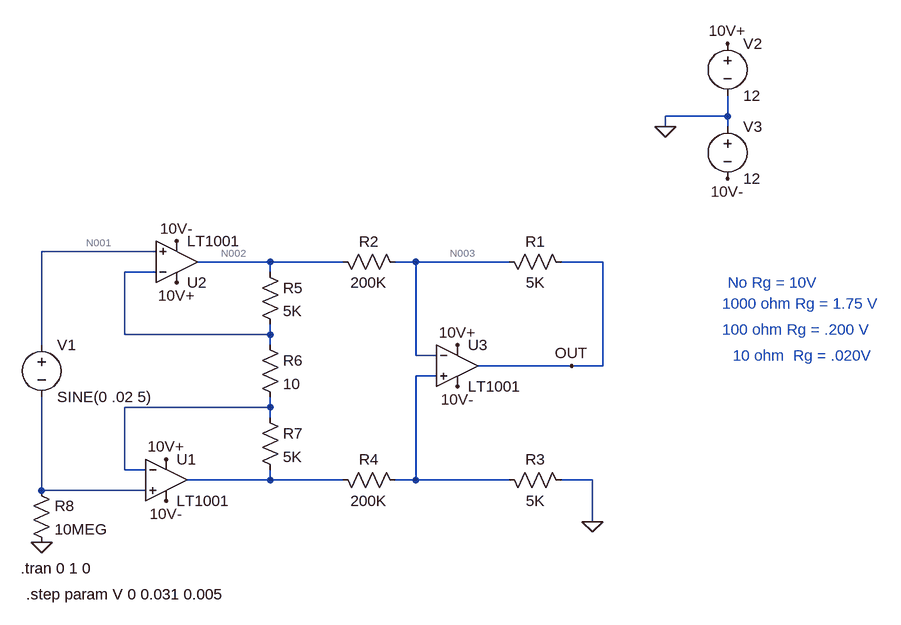
[diagram p0: schematic InAmp.asc]
InAmp.asc, the LTspice schematic file:
Version 4
SHEET 1 1284 680
WIRE 976 -288 976 -320
WIRE 976 -288 880 -288
WIRE 880 -272 880 -288
WIRE 976 -272 976 -288
WIRE 96 -80 -80 -80
WIRE 272 -64 160 -64
WIRE 384 -64 272 -64
WIRE 496 -64 464 -64
WIRE 640 -64 496 -64
WIRE 784 -64 720 -64
WIRE 96 -48 48 -48
WIRE 272 -48 272 -64
WIRE 48 48 48 -48
WIRE 272 48 272 32
WIRE 272 48 48 48
WIRE -80 64 -80 -80
WIRE 272 64 272 48
WIRE 496 80 496 -64
WIRE 528 80 496 80
WIRE 736 96 592 96
WIRE 784 96 784 -64
WIRE 784 96 736 96
WIRE 528 112 496 112
WIRE 272 160 272 144
WIRE 272 160 48 160
WIRE 272 176 272 160
WIRE 48 256 48 160
WIRE 80 256 48 256
WIRE 272 272 272 256
WIRE 272 272 144 272
WIRE 384 272 272 272
WIRE 496 272 496 112
WIRE 496 272 464 272
WIRE 640 272 496 272
WIRE 768 272 720 272
WIRE -80 288 -80 144
WIRE 80 288 -80 288
WIRE 768 336 768 272
FLAG 128 -32 10V+
FLAG 112 240 10V+
FLAG 560 64 10V+
FLAG 128 -96 10V-
FLAG 560 128 10V-
FLAG 112 304 10V-
FLAG 880 -272 0
FLAG 768 336 0
FLAG -80 368 0
FLAG 976 -192 10V-
FLAG 976 -400 10V+
FLAG 736 96 OUT
SYMBOL Opamps\\LT1001 112 208 R0
SYMATTR InstName U1
SYMBOL Opamps\\LT1001 128 0 M180
SYMATTR InstName U2
SYMBOL Opamps\\LT1001 560 32 R0
SYMATTR InstName U3
SYMBOL res 624 -80 M90
WINDOW 0 0 56 VBottom 2
WINDOW 3 32 56 VTop 2
SYMATTR InstName R1
SYMATTR Value 5K
SYMBOL res 368 -80 M90
WINDOW 0 0 56 VBottom 2
WINDOW 3 32 56 VTop 2
SYMATTR InstName R2
SYMATTR Value 200K
SYMBOL res 624 256 M90
WINDOW 0 0 56 VBottom 2
WINDOW 3 32 56 VTop 2
SYMATTR InstName R3
SYMATTR Value 5K
SYMBOL res 368 256 M90
WINDOW 0 0 56 VBottom 2
WINDOW 3 32 56 VTop 2
SYMATTR InstName R4
SYMATTR Value 200K
SYMBOL res 256 -64 R0
SYMATTR InstName R5
SYMATTR Value 5K
SYMBOL res 256 160 R0
SYMATTR InstName R7
SYMATTR Value 5K
SYMBOL voltage -80 48 R0
WINDOW 123 0 0 Left 2
WINDOW 39 0 0 Left 2
SYMATTR InstName V1
SYMATTR Value SINE(0 .02 5)
SYMBOL voltage 976 -416 R0
WINDOW 123 0 0 Left 2
WINDOW 39 0 0 Left 2
SYMATTR InstName V2
SYMATTR Value 12
SYMBOL voltage 976 -288 R0
WINDOW 123 0 0 Left 2
WINDOW 39 0 0 Left 2
SYMATTR InstName V3
SYMATTR Value 12
SYMBOL res -96 272 R0
SYMATTR InstName R8
SYMATTR Value 10MEG
SYMBOL res 256 48 R0
SYMATTR InstName R6
SYMATTR Value 10
TEXT -112 408 Left 2 !.tran 0 1 0
TEXT -104 448 Left 2 !.step param V 0 0.031 0.005
TEXT 968 0 Left 2 ;1000 ohm Rg = 1.75 V
TEXT 968 40 Left 2 ;100 ohm Rg = .200 V
TEXT 984 80 Left 2 ;10 ohm  Rg = .020V
TEXT 976 -32 Left 2 ;No Rg = 10V

The netlist it stands for:
* InAmp.asc
XU1 N008 N006 10V+ 10V- N007 LT1001  ; pins In+ In- V+ V- OUT
XU2 N001 N004 10V+ 10V- N002 LT1001  ; pins In+ In- V+ V- OUT
XU3 N005 N003 10V+ 10V- OUT LT1001  ; pins In+ In- V+ V- OUT
R1 N003 OUT 5K
R2 N002 N003 200K
R3 N005 0 5K
R4 N007 N005 200K
R5 N002 N004 5K
R7 N006 N007 5K
V1 N001 N008 SINE(0 .02 5)
V2 10V+ 0 12
V3 0 10V- 12
R8 N008 0 10MEG
R6 N004 N006 10
.tran 0 1 0
.step param V 0 0.031 0.005
* 1000 ohm Rg = 1.75 V
* 100 ohm Rg = .200 V
* 10 ohm  Rg = .020V
* No Rg = 10V
.lib LTC.lib
.backanno
.end

* Results of the author's LTspice run, read from the files saved beside the schematic
* Operating Point, zero values left out:
*   V(10v+) = 12 V
*   V(10v-) = -12 V
*   I(V3) = -6.75 mA
*   I(V2) = -6.75 mA
*   Ix(u1:3) = 2.25 mA
*   Ix(u1:4) = -2.25 mA
*   Ix(u2:3) = 2.25 mA
*   Ix(u2:4) = -2.25 mA
*   Ix(u3:3) = 2.25 mA
*   Ix(u3:4) = -2.25 mA
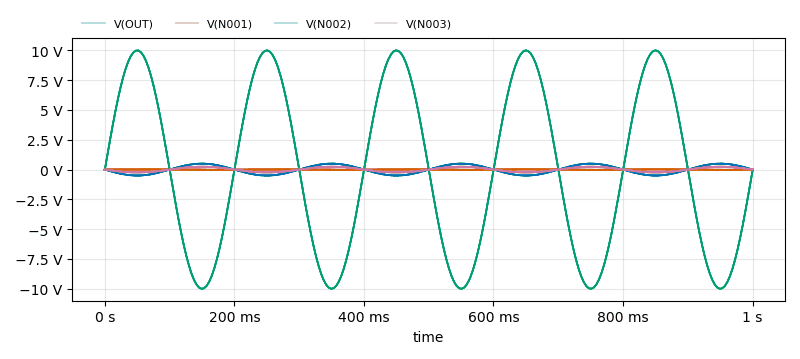
[diagram p1: Transient Analysis of InAmp.asc, plotted from the saved traces]
* Transient Analysis, 11 runs:
*   V(OUT) [run 1]: min -499.6 mV, max 499.6 mV, average -1.112 µV, rms 353.3 mV, last 2.953 mV
*   V(OUT) [run 2]: 0.1257 fV at time=0 s, 0.1257 fV at time=0 s, min 0.1257 fV, max 0.1257 fV
*   V(OUT) [run 3]: min -499.6 mV, max 499.6 mV, average -306.4 nV, rms 353.3 mV, last 2.953 mV
*   V(OUT) [run 4]: 0.1257 fV at time=0 s, 0.1257 fV at time=0 s, min 0.1257 fV, max 0.1257 fV
*   V(OUT) [run 5]: min -499.6 mV, max 499.6 mV, average -306.4 nV, rms 353.3 mV, last 2.953 mV
*   V(OUT) [run 6]: 0.1257 fV at time=0 s, 0.1257 fV at time=0 s, min 0.1257 fV, max 0.1257 fV
*   V(OUT) [run 7]: min -499.6 mV, max 499.6 mV, average -306.4 nV, rms 353.3 mV, last 2.953 mV
*   V(OUT) [run 8]: 0.1257 fV at time=0 s, 0.1257 fV at time=0 s, min 0.1257 fV, max 0.1257 fV
*   V(N001) [run 1]: min -19.99 mV, max 19.99 mV, average 15.91 nV, rms 14.14 mV, last -6.299 µV
*   V(N001) [run 2]: -0.0004993 fV at time=0 s, -0.0004993 fV at time=0 s, min -0.0004993 fV, max -0.0004993 fV
*   V(N001) [run 3]: min -19.99 mV, max 19.99 mV, average -17 nV, rms 14.14 mV, last -6.299 µV
*   V(N001) [run 4]: -0.0004993 fV at time=0 s, -0.0004993 fV at time=0 s, min -0.0004993 fV, max -0.0004993 fV
*   V(N001) [run 5]: min -19.99 mV, max 19.99 mV, average -17 nV, rms 14.14 mV, last -6.299 µV
*   V(N001) [run 6]: -0.0004993 fV at time=0 s, -0.0004993 fV at time=0 s, min -0.0004993 fV, max -0.0004993 fV
*   V(N001) [run 7]: min -19.99 mV, max 19.99 mV, average -17 nV, rms 14.14 mV, last -6.299 µV
*   V(N001) [run 8]: -0.0004993 fV at time=0 s, -0.0004993 fV at time=0 s, min -0.0004993 fV, max -0.0004993 fV
*   V(N002) [run 1]: min -10 V, max 10 V, average 22.24 µV, rms 7.074 V, last -59 mV
*   V(N002) [run 2]: -2.517 fV at time=0 s, -2.517 fV at time=0 s, min -2.517 fV, max -2.517 fV
*   V(N002) [run 3]: min -10 V, max 10 V, average 6.112 µV, rms 7.074 V, last -59 mV
*   V(N002) [run 4]: -2.517 fV at time=0 s, -2.517 fV at time=0 s, min -2.517 fV, max -2.517 fV
*   V(N002) [run 5]: min -10 V, max 10 V, average 6.112 µV, rms 7.074 V, last -59 mV
*   V(N002) [run 6]: -2.517 fV at time=0 s, -2.517 fV at time=0 s, min -2.517 fV, max -2.517 fV
*   V(N002) [run 7]: min -10 V, max 10 V, average 6.112 µV, rms 7.074 V, last -59 mV
*   V(N002) [run 8]: -2.517 fV at time=0 s, -2.517 fV at time=0 s, min -2.517 fV, max -2.517 fV
*   V(N003) [run 1]: min -243.5 mV, max 243.5 mV, average -542.6 nV, rms 172.2 mV, last 1.442 mV
*   V(N003) [run 2]: 0.06126 fV at time=0 s, 0.06126 fV at time=0 s, min 0.06126 fV, max 0.06126 fV
*   V(N003) [run 3]: min -243.5 mV, max 243.5 mV, average -150.3 nV, rms 172.2 mV, last 1.442 mV
*   V(N003) [run 4]: 0.06126 fV at time=0 s, 0.06126 fV at time=0 s, min 0.06126 fV, max 0.06126 fV
*   V(N003) [run 5]: min -243.5 mV, max 243.5 mV, average -150.3 nV, rms 172.2 mV, last 1.442 mV
*   V(N003) [run 6]: 0.06126 fV at time=0 s, 0.06126 fV at time=0 s, min 0.06126 fV, max 0.06126 fV
*   V(N003) [run 7]: min -243.5 mV, max 243.5 mV, average -150.3 nV, rms 172.2 mV, last 1.442 mV
*   V(N003) [run 8]: 0.06126 fV at time=0 s, 0.06126 fV at time=0 s, min 0.06126 fV, max 0.06126 fV